# Altium schematic sheet power.SchDoc: Power
size A4; Organization: Badgerloop Electrical; Address1: 133 Engineering Research Building; Address2: 1500 Engineering Drive; Address3: Madison, Wi 53706
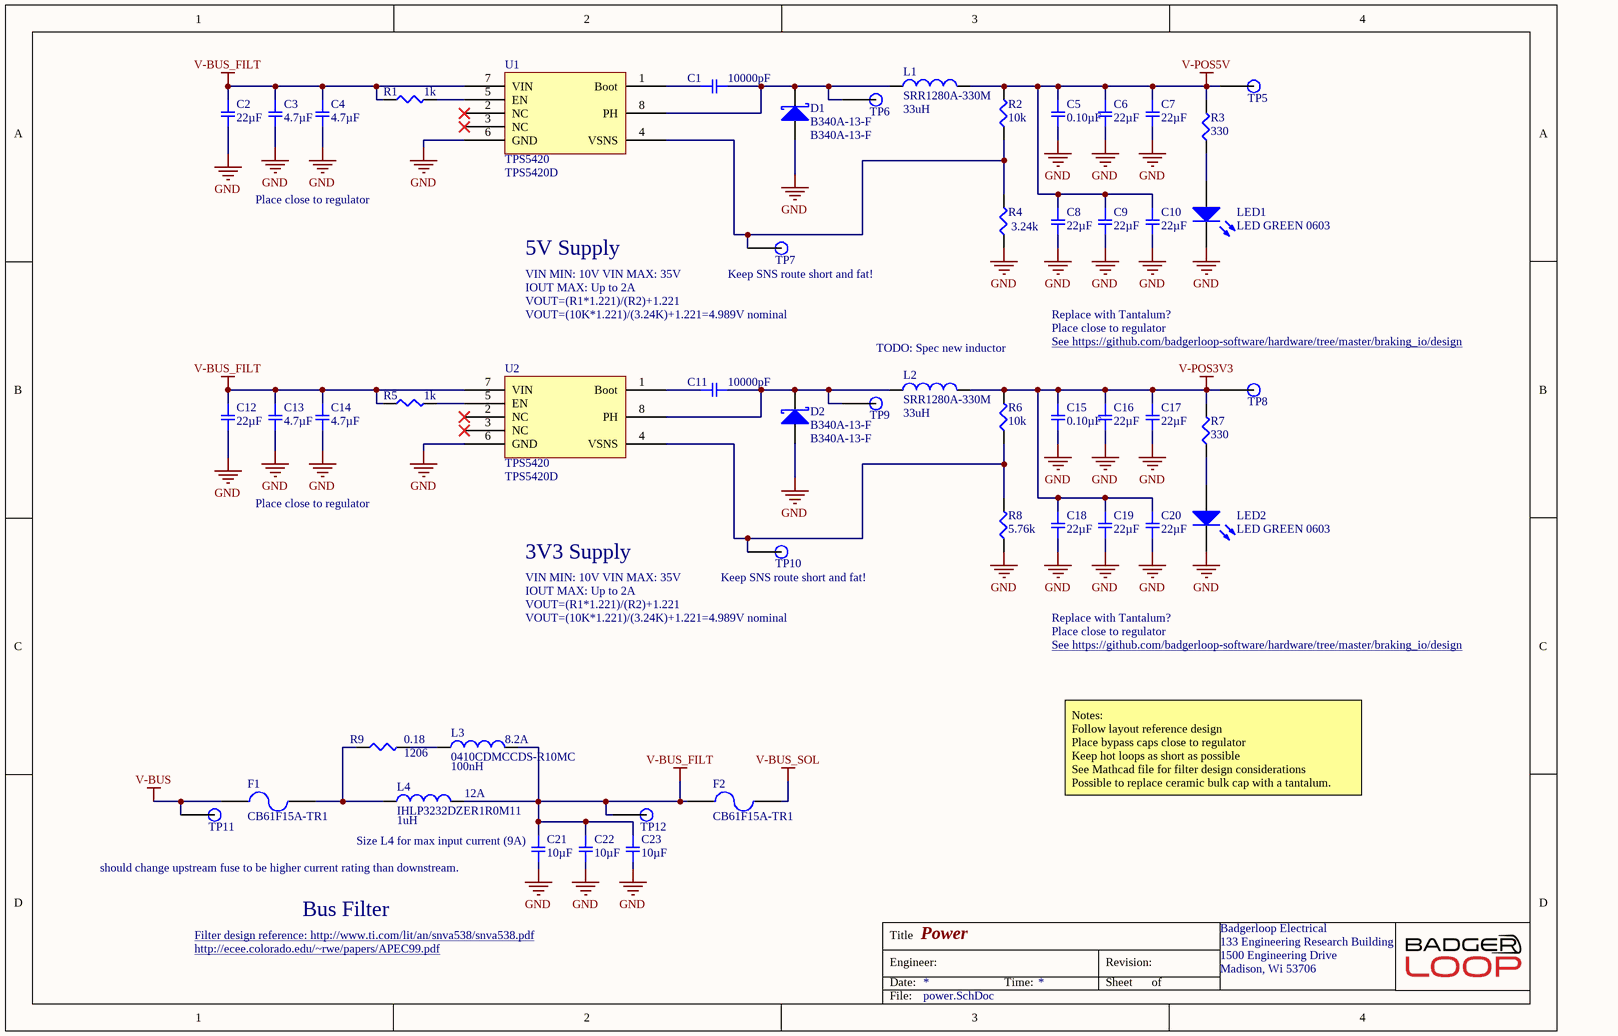
[diagram p0: power.SchDoc]

## Parts
C1  10000pF  [SMD-0805C]
C2  22µF  [SMD-1206C]
C3  4.7µF  [SMD-1206C]
C4  4.7µF  [SMD-1206C]
C5  0.10µF  [SMD-0805C]
C6  22µF  [SMD-1206C]
C7  22µF  [SMD-1206C]
C8  22µF  [SMD-1206C]
C9  22µF  [SMD-1206C]
C10  22µF  [SMD-1206C]
C11  10000pF  [SMD-0805C]
C12  22µF  [SMD-1206C]
C13  4.7µF  [SMD-1206C]
C14  4.7µF  [SMD-1206C]
C15  0.10µF  [SMD-0805C]
C16  22µF  [SMD-1206C]
C17  22µF  [SMD-1206C]
C18  22µF  [SMD-1206C]
C19  22µF  [SMD-1206C]
C20  22µF  [SMD-1206C]
C21  10µF  [SMD-1206C]
C22  10µF  [SMD-1206C]
C23  10µF  [SMD-1206C]
D1  B340A-13-F  [DIOM4326X20N]
D2  B340A-13-F  [DIOM4326X20N]
F1  CB61F15A-TR1  [RESC6132X26N]
F2  CB61F15A-TR1  [RESC6132X26N]
L1  SRR1280A-330M  Inductance: 33uH  [INDM120125X75N]
L2  SRR1280A-330M  Inductance: 33uH  [INDM120125X75N]
L3  0410CDMCCDS-R10MC  Inductance: 100nH  Saturation Current: 8.2A  [INDM4442X20N]
L4  IHLP3232DZER1R0M11  Saturation Current: 12A  Inductance: 1uH  [INDM8682X40N]
LED1  LED GREEN 0603  [LED 0603 GREEN]
LED2  LED GREEN 0603  [LED 0603 GREEN]
R1  1k  [SMD-0805-RES]
R2  10k  [SMD-0805-RES]
R3  330  [SMD-0805-RES]
R4  3.24k  [SMD-0805-RES]
R5  1k  [SMD-0805-RES]
R6  10k  [SMD-0805-RES]
R7  330  [SMD-0805-RES]
R8  5.76k  [SMD-0805-RES]
R9  0.18  Supplier Device Package: 1206  [SMD-1206-RES]
TP5  TP  [Test Point]  (value not drawn)
TP6  TP  [Test Point]  (value not drawn)
TP7  TP  [Test Point]  (value not drawn)
TP8  TP  [Test Point]  (value not drawn)
TP9  TP  [Test Point]  (value not drawn)
TP10  TP  [Test Point]  (value not drawn)
TP11  TP  [Test Point]  (value not drawn)
TP12  TP  [Test Point]  (value not drawn)
U1  TPS5420  Manufacturer Part Number: TPS5420D  [SOP127P600X175-8N]
U2  TPS5420  Manufacturer Part Number: TPS5420D  [SOP127P600X175-8N]

## Nets
GND: C2.2 C3.2 C4.2 C5.2 C6.2 C7.2 C8.2 C9.2 C10.2 C12.2 C13.2 C14.2 C15.2 C16.2 C17.2 C18.2 C19.2 C20.2 C21.2 C22.2 C23.2 D1.1(A) D2.1(A) LED1.2(K) LED2.2(K) R4.1 R8.1 U1.6(GND) U2.6(GND)
V-BUS: F1.1 TP11.1
V-BUS_FILT: C2.1 C3.1 C4.1 C12.1 C13.1 C14.1 C21.1 C22.1 C23.1 F2.1 L3.2 L4.2 R1.1 R5.1 TP12.1 U1.7(VIN) U2.7(VIN)
V-BUS_SOL: F2.2
V-POS3V3: C15.1 C16.1 C17.1 C18.1 C19.1 C20.1 L2.2 R6.2 R7.2 TP8.1
V-POS5V: C5.1 C6.1 C7.1 C8.1 C9.1 C10.1 L1.2 R2.2 R3.2 TP5.1
NetC1_1: C1.1 U1.1(Boot)
NetC1_2: C1.2 D1.2(K) L1.1 TP6.1 U1.8(PH)
NetC11_1: C11.1 U2.1(Boot)
NetC11_2: C11.2 D2.2(K) L2.1 TP9.1 U2.8(PH)
NetF1_2: F1.2 L4.1 R9.1
NetL3_1: L3.1 R9.2
NetLED1_1: LED1.1(A) R3.1
NetLED2_1: LED2.1(A) R7.1
NetR1_2: R1.2 U1.5(EN)
NetR2_1: R2.1 R4.2 TP7.1 U1.4(VSNS)
NetR5_2: R5.2 U2.5(EN)
NetR6_1: R6.1 R8.2 TP10.1 U2.4(VSNS)

Not connected (* = marked no-connect by the designer): U1 2(NC)* 3(NC)*; U2 2(NC)* 3(NC)*

## Notes on the sheet
- Place close to regulator
- 5V Supply
- VIN MIN: 10V VIN MAX: 35V
- IOUT MAX: Up to 2A
- VOUT=(R1*1.221)/(R2)+1.221
- (near TP7) Keep SNS route short and fat!
- VOUT=(10K*1.221)/(3.24K)+1.221=4.989V nominal
- TODO: Spec new inductor
- Replace with Tantalum?
- See https://github.com/badgerloop-software/hardware/tree/master/braking_io/design <https://github.com/badgerloop-software/hardware/tree/master/braking_io/design>
- 3V3 Supply
- (near TP10) Keep SNS route short and fat!
- Notes:
  Follow layout reference design
  Place bypass caps close to regulator
  Keep hot loops as short as possible
  See Mathcad file for filter design considerations
  Possible to replace ceramic bulk cap with a tantalum.
  CAC
- (near C21) Size L4 for max input current (9A)
- (near C21) should change upstream fuse to be higher current rating than downstream.
- Bus Filter
- Filter design reference: http://www.ti.com/lit/an/snva538/snva538.pdf <http://www.ti.com/lit/an/snva538/snva538.pdf>
- http://ecee.colorado.edu/~rwe/papers/APEC99.pdf
- Title
- Engineer:
- Date:
- Time:
- Revision:
- Sheet
- of
- File:

## Library data of the parts
C1 C11 = GC321AD72E103KX01D: CAP CER 10000PF 250V X7T 0805; Manufacturer: Murata Electronics North America; Factory Stock: 0; Unit Price (USD): 0.3; Minimum Quantity: 1; Tolerance: ±10%; Datasheets: http://search.murata.co.jp/Ceramy/image/img/A01X/G101/ENG/GC321AD72E103KX01-01.pdf; Image: //media.digikey.com/Renders/Murata%20Renders/0805(GC3)200x125.jpg; Digi-Key Part Number: 490-13986-1-ND; Part Number: GC321AD72E103KX01D; Quantity Available: 4000; @ qty: 0; Packaging: Cut Tape (CT); Series: GC3; Part Status: Active; Value: 10000pF; Voltage: 250V; Temperature Coefficient: X7T; Operating Temperature: -55°C ~ 125°C; Features: -; Ratings: AEC-Q200; Applications: Automotive; Mounting Type: Surface Mount, MLCC; Package / Case: 0805 (2012 Metric); Size / Dimension: 0.079" L x 0.049" W (2.00mm x 1.25mm); Height - Seated (Max): -; Thickness (Max): 0.039" (1.00mm); Lead Spacing: -; Lead Style: -
C2 C6-C10 C12 C16-C20 = GRT31CR61E226ME01L: CAP CER 22UF 25V X5R 1206; Manufacturer: Murata Electronics North America; Factory Stock: 0; Unit Price (USD): 0.52; Minimum Quantity: 1; Tolerance: ±20%; Datasheets: http://search.murata.co.jp/Ceramy/image/img/A01X/G101/ENG/GRT31CR61E226ME01-01.pdf; Image: //media.digikey.com/Renders/Murata%20Renders/GR331BD72E473KW01L.jpg; Digi-Key Part Number: 490-12451-1-ND; Part Number: GRT31CR61E226ME01L; Quantity Available: 4719; @ qty: 0; Packaging: Cut Tape (CT); Series: GRT; Part Status: Active; Value: 22µF; Voltage: 25V; Temperature Coefficient: X5R; Operating Temperature: -55°C ~ 85°C; Features: -; Ratings: AEC-Q200; Applications: Automotive; Mounting Type: Surface Mount, MLCC; Package / Case: 1206 (3216 Metric); Size / Dimension: 0.126" L x 0.063" W (3.20mm x 1.60mm); Height - Seated (Max): -; Thickness (Max): 0.071" (1.80mm); Lead Spacing: -; Lead Style: -
C3 C4 C13 C14 = GCM31CC71H475KA03L: CAP CER 4.7UF 50V X7S 1206; Manufacturer: Murata Electronics North America; Factory Stock: 0; Unit Price (USD): 0.57; Minimum Quantity: 1; Tolerance: ±10%; Datasheets: http://www.murata.com/~/media/webrenewal/support/library/catalog/products/capacitor/mlcc/c03e.ashx; Image: //media.digikey.com/Renders/Murata%20Renders/GR331BD72E473KW01L.jpg; Digi-Key Part Number: 490-11167-1-ND; Part Number: GCM31CC71H475KA03L; Quantity Available: 11700; @ qty: 0; Packaging: Cut Tape (CT); Series: GCM; Part Status: Active; Value: 4.7µF; Voltage: 50V; Temperature Coefficient: X7S; Operating Temperature: -55°C ~ 125°C; Features: -; Ratings: AEC-Q200; Applications: Automotive; Mounting Type: Surface Mount, MLCC; Package / Case: 1206 (3216 Metric); Size / Dimension: 0.126" L x 0.063" W (3.20mm x 1.60mm); Height - Seated (Max): -; Thickness (Max): 0.071" (1.80mm); Lead Spacing: -; Lead Style: -
C5 C15 = GRM21B7U1A104JA01L: CAP CER 0.1UF 10V U2J 0805; Manufacturer: Murata Electronics North America; Factory Stock: 0; Unit Price (USD): 0.4; Minimum Quantity: 1; Tolerance: ±5%; Datasheets: http://www.murata.com/~/media/webrenewal/support/library/catalog/products/capacitor/mlcc/c02e.pdf; Image: //media.digikey.com/Renders/Murata%20Renders/0805%20(2012%20Metric)%20.85mm.jpg; Digi-Key Part Number: 490-11592-1-ND; Part Number: GRM21B7U1A104JA01L; Quantity Available: 3390; @ qty: 0; Packaging: Cut Tape (CT); Series: GRM; Part Status: Active; Value: 0.10µF; Voltage: 10V; Temperature Coefficient: U2J; Operating Temperature: -55°C ~ 125°C; Features: -; Ratings: -; Applications: General Purpose; Mounting Type: Surface Mount, MLCC; Package / Case: 0805 (2012 Metric); Size / Dimension: 0.079" L x 0.049" W (2.00mm x 1.25mm); Height - Seated (Max): -; Thickness (Max): 0.053" (1.35mm); Lead Spacing: -; Lead Style: -
C21-C23 = GRT31CR61H106ME01L: CAP CER 10UF 50V X5R 1206; Manufacturer: Murata Electronics North America; Factory Stock: 0; Unit Price (USD): 0.42; Minimum Quantity: 1; Tolerance: ±20%; Datasheets: http://search.murata.co.jp/Ceramy/image/img/A01X/G101/ENG/GRT31CR61H106ME01-01.pdf; Image: //media.digikey.com/Renders/Murata%20Renders/GR331BD72E473KW01L.jpg; Digi-Key Part Number: 490-12457-1-ND; Part Number: GRT31CR61H106ME01L; Quantity Available: 3394; @ qty: 0; Packaging: Cut Tape (CT); Series: GRT; Part Status: Active; Value: 10µF; Voltage: 50V; Temperature Coefficient: X5R; Operating Temperature: -55°C ~ 85°C; Features: -; Ratings: AEC-Q200; Applications: Automotive; Mounting Type: Surface Mount, MLCC; Package / Case: 1206 (3216 Metric); Size / Dimension: 0.126" L x 0.063" W (3.20mm x 1.60mm); Height - Seated (Max): -; Thickness (Max): 0.071" (1.80mm); Lead Spacing: -; Lead Style: -
D1 D2 = B340A-13-F: DIODE SCHOTTKY 40V 3A SMA; Manufacturer: Diodes; Element Configuration: Single; Peak Reverse Current: 500uA; Forward Voltage: 500mV; Max Forward Surge Current (Ifsm): 80A; Polarity: Standard; Capacitance: 250pF; Supplier 1: Digi-Key; Stock 1: 438328; Pricing 1: 1=0.42000, 10=0.33900, 100=0.23070, 500=0.17304, 1000=0.12978 (USD); RoHS: Yes; Mount: Surface Mount; Case/Package: SMA; Number of Pins: 2; Weight: 0.002258oz; Contact Plating: Tin,Matte; Min Operating Temperature: -55°C; Max Operating Temperature: 125°C; Forward Current: 3A; Max Repetitive Reverse Voltage (Vrrm): 40V; Packaging: Tape and Reel; Peak Non-Repetitive Surge Current: 80A; Package Quantity: 5000; Average Rectified Current: 3A; Termination: SMD/SMT; Voltage Rating (DC): 40V; Current Rating: 3A; Output Current: 3A; Current: 3A; Voltage: 40V; Max Reverse Voltage (DC): 40V; Length: 4.6mm; Height: 2.3mm; Width: 2.92mm; Radiation Hardening: No; REACH SVHC: No SVHC; Lead Free: Lead Free; ComponentLink1URL: https://datasheet.ciiva.com/26949/getdatasheetpartid-143394-26949352.pdf?src-supplier=Verical; ComponentLink1Description: https://datasheet.ciiva.com/26949/getdatasheetpartid-143394-26949352.pdf?src-supplier=Verical; ComponentLink2URL: https://datasheet.ciiva.com/4245/861ds30891-4245763.pdf?src-supplier=Arrow; ComponentLink2Description: https://datasheet.ciiva.com/4245/861ds30891-4245763.pdf?src-supplier=Arrow; ComponentLink3URL: https://datasheet.ciiva.com/1177/ds30891-1177476.pdf?src-supplier=Element14; ComponentLink3Description: https://datasheet.ciiva.com/1177/ds30891-1177476.pdf?src-supplier=Element14; ComponentLink4URL: https://datasheet.ciiva.com/913/ds30891-913638.pdf?src-supplier=Digi-Key; ComponentLink4Description: https://datasheet.ciiva.com/913/ds30891-913638.pdf?src-supplier=Digi-Key; ComponentLink5URL: https://datasheet.ciiva.com/46393/1911813-46393773.pdf?src-supplier=Element14; ComponentLink5Description: https://datasheet.ciiva.com/46393/1911813-46393773.pdf?src-supplier=Element14; ComponentLink6URL: https://datasheet.ciiva.com/1240/ds30891-1240228.pdf?src-supplier=Newark; ComponentLink6Description: https://datasheet.ciiva.com/1240/ds30891-1240228.pdf?src-supplier=Newark; ComponentLink7URL: https://datasheet.ciiva.com/913/ds30891-913637.pdf?src-supplier=Digi-Key; ComponentLink7Description: https://datasheet.ciiva.com/913/ds30891-913637.pdf?src-supplier=Digi-Key; ComponentLink8URL: https://datasheet.ciiva.com/913/ds30891-913639.pdf?src-supplier=Digi-Key; ComponentLink8Description: https://datasheet.ciiva.com/913/ds30891-913639.pdf?src-supplier=Digi-Key; Supplier Part Number 1: B340A-FDICT-ND; Manufacturer Part Number: B340A-13-F
F1 F2 = CB61F15A-TR1: Manufacturer: Eaton; Current Rating: 15A; Voltage Rating (AC): 125V; DC Cold Resistance: 4mR; Fuse Type: Board Mount (Cartridge Style Excluded); Approvals: cULus,PSE; Supplier 1: Digi-Key; Manufacturer Part Number: CB61F15A-TR1; Stock 1: 11809; Pricing 1: 1=1.15000, 5=1.11800, 10=1.04600, 50=0.86600, 100=0.72160, 250=0.70356, 500=0.59532 (USD); RoHS: Yes; Mount: Surface Mount; Case/Package: SMD/SMT; Packaging: Tape and Reel; Voltage Rating (DC): 125V; Voltage Rating: 125V; Length: 0.24inch; Height: 0.101inch; Width: 0.101inch; Depth: 2.57mm; Lead Free: Lead Free; ComponentLink1URL: http://components.arrow.com/part/dataview/0323_05918082?src-supplier=Arrow+Europe; ComponentLink1Description: http://components.arrow.com/part/dataview/0323_05918082?src-supplier=Arrow+Europe; ComponentLink2URL: http://www.cooperindustries.com/content/dam/public/bussmann/Electronics/Resources/product-datasheets/bus-elx-ds-4377-cb61f.pdf?src-supplier=Avnet+Asia; ComponentLink2Description: http://www.cooperindustries.com/content/dam/public/bussmann/Electronics/Resources/product-datasheets/bus-elx-ds-4377-cb61f.pdf?src-supplier=Avnet+Asia; ComponentLink3URL: http://www.cooperindustries.com/content/dam/public/bussmann/Electronics/Resources/product-datasheets/bus-elx-ds-4377-cb61f.pdf?src-supplier=Avnet; ComponentLink3Description: http://www.cooperindustries.com/content/dam/public/bussmann/Electronics/Resources/product-datasheets/bus-elx-ds-4377-cb61f.pdf?src-supplier=Avnet; ComponentLink4URL: http://www.cooperindustries.com/content/dam/public/bussmann/Electronics/Resources/product-datasheets/bus-elx-ds-4377-cb61f.pdf?src-supplier=Digi-Key; ComponentLink4Description: http://www.cooperindustries.com/content/dam/public/bussmann/Electronics/Resources/product-datasheets/bus-elx-ds-4377-cb61f.pdf?src-supplier=Digi-Key; Supplier Part Number 1: 283-4104-1-ND
L1 L2 = SRR1280A-330M: Inductor Power Shielded Wirewound 33uH 20% 1KHz 28Q-Factor Ferrite 3.5A 57mOhm DCR Automotive T/R; Manufacturer: Bourns; Saturation Current: 3.3A; DC Resistance (DCR): 57mR; Self Resonant Frequency: 9.5MHz; Supplier 1: Newark; Stock 1: 0; Pricing 1: 2400=0.54000, 4000=0.48600, 6000=0.46800, 10000=0.45800 (USD); RoHS: Yes; Mount: Surface Mount; Case/Package: Nonstandard; Core Material: Ferrite; Min Operating Temperature: -40°C; Max Operating Temperature: 125°C; Package Quantity: 400; Packaging: Cut Tape; Tolerance: 20%; Current Rating: 3.5A; Shielding: Shielded; Test Frequency: 1kHz; Inductance Tolerance: 20%; RMS Current (Irms): 3.5A; Military Standard: Not; Max DC Current: 3.5A; Length: 0.492inch; Height: 7.5mm; Width: 0.492inch; Height - Seated (Max): 0.315inch; Depth: 12.8mm; Ratings: AEC-Q200; REACH SVHC: No SVHC; ComponentLink1URL: https://datasheet.ciiva.com/41859/srr1280a-41859670.pdf?src-supplier=Digi-Key; ComponentLink1Description: https://datasheet.ciiva.com/41859/srr1280a-41859670.pdf?src-supplier=Digi-Key; ComponentLink2URL: https://datasheet.ciiva.com/48684/srr1280a-48684991.pdf?src-supplier=Avnet; ComponentLink2Description: https://datasheet.ciiva.com/48684/srr1280a-48684991.pdf?src-supplier=Avnet; Supplier Part Number 1: 06X7909; Manufacturer Part Number: SRR1280A-330M
L3 = 0410CDMCCDS-R10MC: Manufacturer: Sumida; Supplier 1: Digi-Key; Manufacturer Part Number: 0410CDMCCDS-R10MC; Stock 1: 5994; Pricing 1: 1=0.93000, 10=0.81700, 100=0.58360, 500=0.49024, 1000=0.39687 (USD); RoHS: No; Supplier Part Number 1: 308-2523-1-ND
L4 = IHLP3232DZER1R0M11: Fixed Inductors 1uH 20% Low Profile; Manufacturer: Vishay Dale; Core Material: Metal,Composite,Ferrite; Current Rating: 18.2A; Shielding: Shielded; Self Resonant Frequency: 49MHz; DC Resistance (DCR): 4.63mR; Test Frequency: 100kHz; Supplier 1: Digi-Key; Manufacturer Part Number: IHLP3232DZER1R0M11; Stock 1: 9463; Pricing 1: 1=1.61000, 10=1.49500, 100=1.08100 (USD); RoHS: Yes; Mount: Surface Mount; Case/Package: 3232; Number of Pins: 2; Min Operating Temperature: -55°C; Max Operating Temperature: 125°C; Inductance Tolerance: 20%; Packaging: Tape and Reel; Tolerance: 20%; Package Quantity: 500; Max DC Current: 18.2A; Termination: SMD/SMT; RMS Current (Irms): 18.2A; Military Standard: Not; Length: 8.64mm; Height: 4mm; Width: 0.322inch; Height - Seated (Max): 0.157inch; Depth: 8.94mm; Radiation Hardening: No; REACH SVHC: Unknown; Lead Free: Lead Free; ComponentLink1URL: https://datasheet.ciiva.com/6692/ihlp-3232dz-11-6692199.pdf?src-supplier=Digi-Key; ComponentLink1Description: https://datasheet.ciiva.com/6692/ihlp-3232dz-11-6692199.pdf?src-supplier=Digi-Key; ComponentLink2URL: https://datasheet.ciiva.com/6692/ihlp-3232dz-11-6692200.pdf?src-supplier=Digi-Key; ComponentLink2Description: https://datasheet.ciiva.com/6692/ihlp-3232dz-11-6692200.pdf?src-supplier=Digi-Key; ComponentLink3URL: https://datasheet.ciiva.com/6692/ihlp-3232dz-11-6692201.pdf?src-supplier=Digi-Key; ComponentLink3Description: https://datasheet.ciiva.com/6692/ihlp-3232dz-11-6692201.pdf?src-supplier=Digi-Key; ComponentLink4URL: https://datasheet.ciiva.com/17113/70231623-17113262.pdf?src-supplier=Allied+Electronics; ComponentLink4Description: https://datasheet.ciiva.com/17113/70231623-17113262.pdf?src-supplier=Allied+Electronics; Supplier Part Number 1: 541-1348-1-ND
LED1 LED2 = LED GREEN 0603: Manufacturer: Lite-On Inc.; Manufacturer P/N: LTST-C190KGKT; Digikey P/N: 160-1435-1-ND; Package / Case: 0603; Color: GREEN
R1 R5 = ERJ-P06J102V: RES SMD 1K OHM 5% 1/2W 0805; Manufacturer: Panasonic Electronic Components; Factory Stock: 0; Unit Price (USD): 0.01839; @ qty: 1500; Minimum Quantity: 1; Power (Watts): 0.5W, 1/2W; Temperature Coefficient: ±200ppm/°C; Part Number: ERJ-P06J102V; Datasheets: https://industrial.panasonic.com/cdbs/www-data/pdf/RDA0000/AOA0000C243.pdf; Image: //media.digikey.com/Renders/Panasonic%20Renders/ERJ-0805%20Pkg.jpg; Digi-Key Part Number: P1.0KADCT-ND; Quantity Available: 124757; Packaging: Cut Tape (CT); Series: ERJ; Part Status: Active; Value: 1k; Tolerance: ±5%; Composition: Thick Film; Features: Automotive AEC-Q200, Pulse Withstanding; Operating Temperature: -55°C ~ 155°C; Package / Case: 0805 (2012 Metric); Supplier Device Package: 0805; Size / Dimension: 0.079" L x 0.049" W (2.00mm x 1.25mm); Height - Seated (Max): 0.028" (0.70mm); Number of Terminations: 2; Failure Rate: -
R2 R6 = ERJ-P06J103V: RES SMD 10K OHM 5% 1/2W 0805; Manufacturer: Panasonic Electronic Components; Factory Stock: 0; Unit Price (USD): 0.01839; @ qty: 1500; Minimum Quantity: 1; Power (Watts): 0.5W, 1/2W; Temperature Coefficient: ±200ppm/°C; Part Number: ERJ-P06J103V; Datasheets: https://industrial.panasonic.com/cdbs/www-data/pdf/RDA0000/AOA0000C243.pdf; Image: //media.digikey.com/Renders/Panasonic%20Renders/ERJ-0805%20Pkg.jpg; Digi-Key Part Number: P10KADCT-ND; Quantity Available: 413576; Packaging: Cut Tape (CT); Series: ERJ; Part Status: Active; Value: 10k; Tolerance: ±5%; Composition: Thick Film; Features: Automotive AEC-Q200, Pulse Withstanding; Operating Temperature: -55°C ~ 155°C; Package / Case: 0805 (2012 Metric); Supplier Device Package: 0805; Size / Dimension: 0.079" L x 0.049" W (2.00mm x 1.25mm); Height - Seated (Max): 0.028" (0.70mm); Number of Terminations: 2; Failure Rate: -
R3 R7 = ERJ-P06J331V: RES SMD 330 OHM 5% 1/2W 0805; Manufacturer: Panasonic Electronic Components; Factory Stock: 0; Unit Price (USD): 0.01839; @ qty: 1500; Minimum Quantity: 1; Power (Watts): 0.5W, 1/2W; Temperature Coefficient: ±200ppm/°C; Part Number: ERJ-P06J331V; Datasheets: https://industrial.panasonic.com/cdbs/www-data/pdf/RDA0000/AOA0000C243.pdf; Image: //media.digikey.com/Renders/Panasonic%20Renders/ERJ-0805%20Pkg.jpg; Digi-Key Part Number: P330ADCT-ND; Quantity Available: 74125; Packaging: Cut Tape (CT); Series: ERJ; Part Status: Active; Value: 330; Tolerance: ±5%; Composition: Thick Film; Features: Automotive AEC-Q200, Pulse Withstanding; Operating Temperature: -55°C ~ 155°C; Package / Case: 0805 (2012 Metric); Supplier Device Package: 0805; Size / Dimension: 0.079" L x 0.049" W (2.00mm x 1.25mm); Height - Seated (Max): 0.028" (0.70mm); Number of Terminations: 2; Failure Rate: -
R4 = ERJ-6ENF3241V: RES SMD 3.24K OHM 1% 1/8W 0805; Manufacturer: Panasonic Electronic Components; Factory Stock: 0; Unit Price (USD): 0.00729; @ qty: 1500; Minimum Quantity: 1; Power (Watts): 0.125W, 1/8W; Temperature Coefficient: ±100ppm/°C; Part Number: ERJ-6ENF3241V; Datasheets: http://industrial.panasonic.com/www-cgi/jvcr13pz.cgi?E+PZ+3+AOA0002+ERJ6ENF3241V+7+WW; Image: //media.digikey.com/Renders/Panasonic%20Renders/ERJ-0805%20Pkg.jpg; Digi-Key Part Number: P3.24KCCT-ND; Quantity Available: 47619; Packaging: Cut Tape (CT); Series: ERJ; Part Status: Active; Value: 3.24k; Tolerance: ±1%; Composition: Thick Film; Features: Automotive AEC-Q200; Operating Temperature: -55°C ~ 155°C; Package / Case: 0805 (2012 Metric); Supplier Device Package: 0805; Size / Dimension: 0.079" L x 0.049" W (2.00mm x 1.25mm); Height - Seated (Max): 0.028" (0.70mm); Number of Terminations: 2; Failure Rate: -
R8 = ERJ-6ENF5761V: RES SMD 5.76K OHM 1% 1/8W 0805; Manufacturer: Panasonic Electronic Components; Factory Stock: 0; Unit Price (USD): 0.00729; @ qty: 1500; Minimum Quantity: 1; Power (Watts): 0.125W, 1/8W; Temperature Coefficient: ±100ppm/°C; Part Number: ERJ-6ENF5761V; Datasheets: http://industrial.panasonic.com/www-cgi/jvcr13pz.cgi?E+PZ+3+AOA0002+ERJ6ENF5761V+7+WW; Image: //media.digikey.com/Renders/Panasonic%20Renders/ERJ-0805%20Pkg.jpg; Digi-Key Part Number: P5.76KCCT-ND; Quantity Available: 40014; Packaging: Cut Tape (CT); Series: ERJ; Part Status: Active; Value: 5.76k; Tolerance: ±1%; Composition: Thick Film; Features: Automotive AEC-Q200; Operating Temperature: -55°C ~ 155°C; Package / Case: 0805 (2012 Metric); Supplier Device Package: 0805; Size / Dimension: 0.079" L x 0.049" W (2.00mm x 1.25mm); Height - Seated (Max): 0.028" (0.70mm); Number of Terminations: 2; Failure Rate: -
R9 = ERJ-8BSFR18V: RES SMD 0.18 OHM 1% 1/2W 1206; Manufacturer: Panasonic Electronic Components; Factory Stock: 0; Unit Price (USD): 0.11739; @ qty: 1500; Minimum Quantity: 1; Power (Watts): 0.5W, 1/2W; Temperature Coefficient: ±250ppm/°C; Part Number: ERJ-8BSFR18V; Datasheets: https://industrial.panasonic.com/cdbs/www-data/pdf/RDA0000/AOA0000C239.pdf; Image: //media.digikey.com/Renders/Panasonic%20Renders/ERJ-1206%20Pkg.jpg; Digi-Key Part Number: P17683CT-ND; Quantity Available: 1772; Packaging: Cut Tape (CT); Series: ERJ; Part Status: Active; Value: 0.18; Tolerance: ±1%; Composition: Thick Film; Features: Automotive AEC-Q200, Current Sense; Operating Temperature: -55°C ~ 125°C; Package / Case: 1206 (3216 Metric); Size / Dimension: 0.126" L x 0.063" W (3.20mm x 1.60mm); Height - Seated (Max): 0.028" (0.70mm); Number of Terminations: 2; Failure Rate: -
TP5-TP12 = TP: SMD TEST POINT
U1 U2 = TPS5420: Manufacturer: Texas Instruments; Output Current: 2A; Switching Frequency: 500kHz; Output Voltage: 31V; Quiescent Current: 3mA; Number of Outputs: 1; Max Input Voltage: 36V; Min Input Voltage: 5.5V; Synchronous Rectifier: No; Min Output Voltage: 1.23V; Output Type: Adjustable; Efficiency: 95%; Supplier 1: Digi-Key; Stock 1: 5221; Pricing 1: 1=3.78000, 10=3.39400, 75=3.20853, 150=2.78073, 525=2.36716, 1050=1.99640, 2550=1.89658, 5025=1.82528 (USD); RoHS: Yes; Case/Package: D; Number of Pins: 8; Weight: 0.002677oz; Min Operating Temperature: -40°C; Max Operating Temperature: 125°C; Packaging: Rail/Tube; Package Quantity: 75; Max Output Voltage: 31V; Max Output Current: 2A; Operating Supply Voltage: 36V; Length: 4.9mm; Height: 1.58mm; Width: 3.91mm; Radiation Hardening: No; Lead Free: Lead Free; REACH SVHC: No SVHC; ComponentLink1URL: https://datasheet.ciiva.com/4880/slvs642c-120503-4880259.pdf?src-supplier=Mouser; ComponentLink1Description: https://datasheet.ciiva.com/4880/slvs642c-120503-4880259.pdf?src-supplier=Mouser; ComponentLink2URL: https://datasheet.ciiva.com/15113/getdatasheetpartid-188336-15113748.pdf?src-supplier=Verical; ComponentLink2Description: https://datasheet.ciiva.com/15113/getdatasheetpartid-188336-15113748.pdf?src-supplier=Verical; ComponentLink3URL: https://datasheet.ciiva.com/27051/1113040-27051457.pdf?src-supplier=Jameco; ComponentLink3Description: https://datasheet.ciiva.com/27051/1113040-27051457.pdf?src-supplier=Jameco; ComponentLink4URL: https://datasheet.ciiva.com/26896/tps5420d-26896666.pdf?src-supplier=IIIC; ComponentLink4Description: https://datasheet.ciiva.com/26896/tps5420d-26896666.pdf?src-supplier=IIIC; ComponentLink5URL: https://datasheet.ciiva.com/2026/tps5420-2026757.pdf?src-supplier=Digi-Key; ComponentLink5Description: https://datasheet.ciiva.com/2026/tps5420-2026757.pdf?src-supplier=Digi-Key; ComponentLink6URL: https://datasheet.ciiva.com/7993/1764415-7993820.pdf?src-supplier=Element14; ComponentLink6Description: https://datasheet.ciiva.com/7993/1764415-7993820.pdf?src-supplier=Element14; ComponentLink7URL: https://datasheet.ciiva.com/3220/tps5420-3220182.pdf?src-supplier=Avnet; ComponentLink7Description: https://datasheet.ciiva.com/3220/tps5420-3220182.pdf?src-supplier=Avnet; ComponentLink8URL: https://datasheet.ciiva.com/26248/tps5420-26248554.pdf?src-supplier=Avnet+Europe; ComponentLink8Description: https://datasheet.ciiva.com/26248/tps5420-26248554.pdf?src-supplier=Avnet+Europe; Supplier Part Number 1: 296-19671-5-ND